# EAGLE design diode_test (EAGLE 6.6.0)
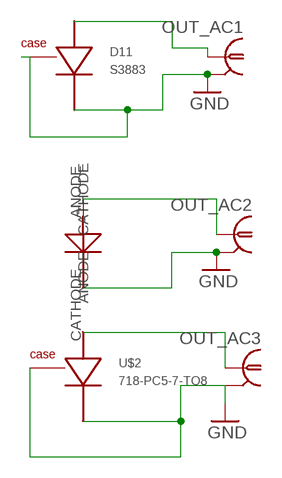
[diagram p0: schematic, sheet 1]

## Parts
D11  S3883  [S3883-CASE]
OUT_AC1  BNC-H  [BNC90]
OUT_AC2  BNC-H  [BNC90]
OUT_AC3  BNC-H  [BNC90]
U$1  718-PC5-7-TO5  [718-PC5-7-TO5]
U$2  718-PC5-7-TO8  [718-PC5-7-TO8]

## Nets
GND: D11.CASE D11.CATHODE OUT_AC1.2 OUT_AC2.2 OUT_AC3.2 U$1.CATHODE U$2.CASE U$2.CATHODE
N$2: D11.ANODE OUT_AC1.1
N$4: OUT_AC2.1 U$1.ANODE
N$6: OUT_AC3.1 U$2.ANODE

## Library data of the parts
D11 = brian_lbr:S3883: Hamamatsu S3883 photodiode
OUT_AC1-OUT_AC3 = connector-jqi:BNC: BNC Connector.; DIGIKEY: A32260-ND
U$1 = brian_lbr:718-PC5-7-TO5
U$2 = brian_lbr:718-PC5-7-TO8

## Board
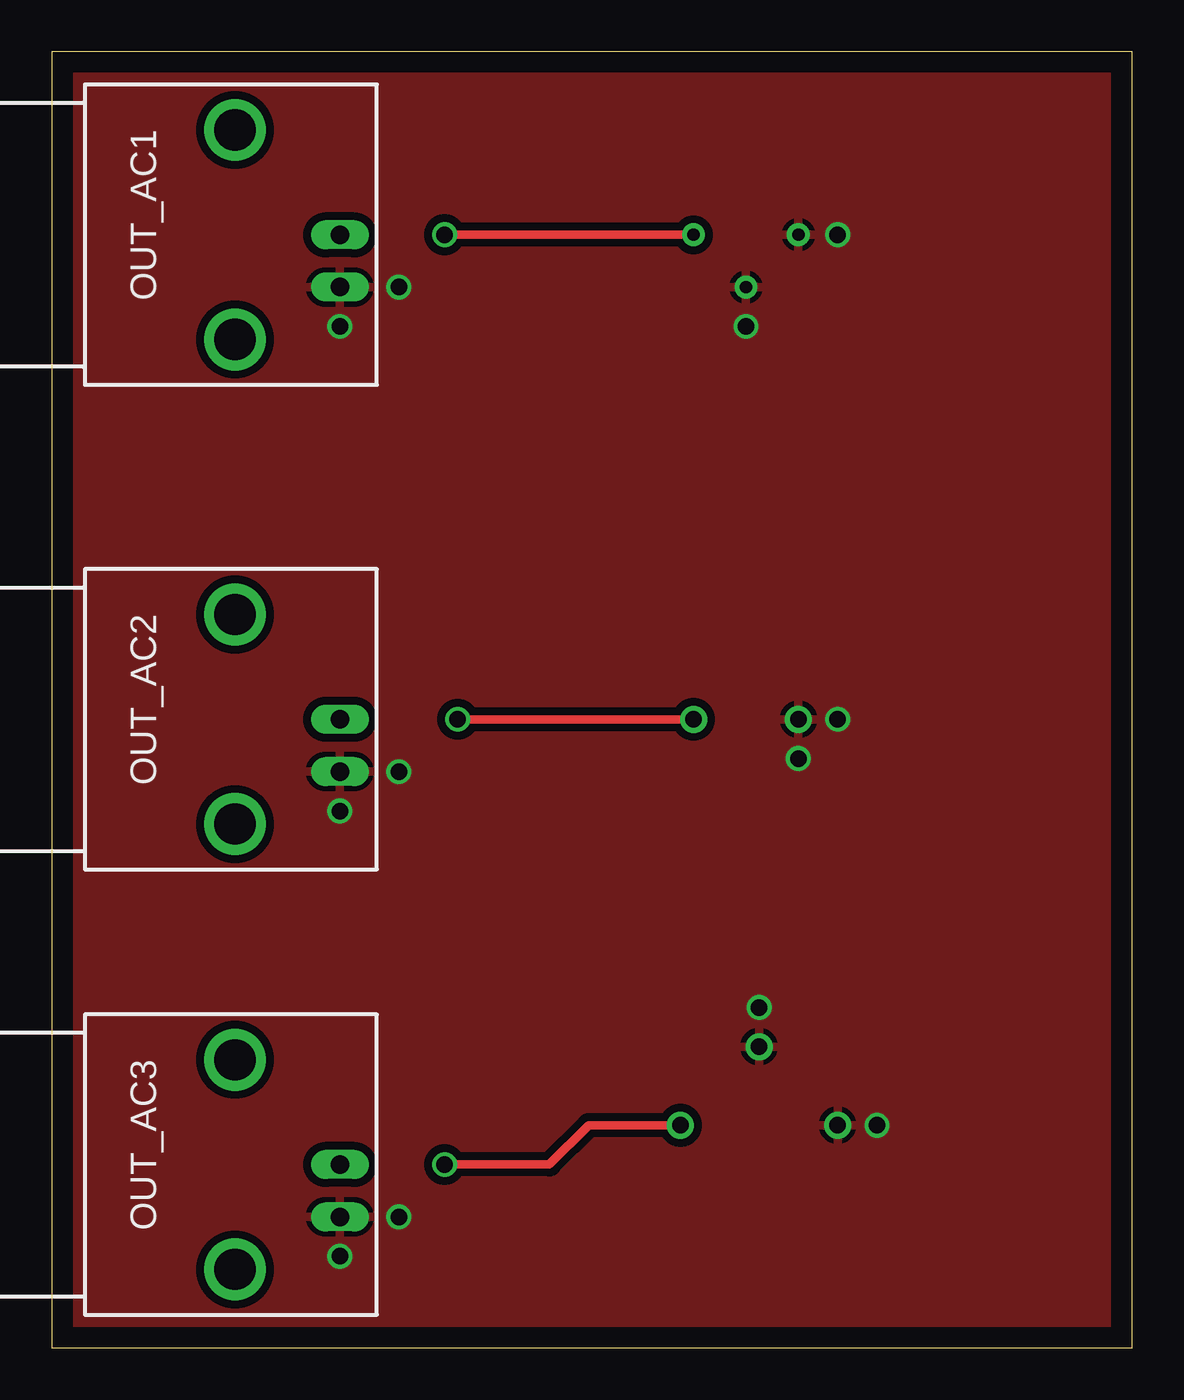
[diagram p1: board, top side]
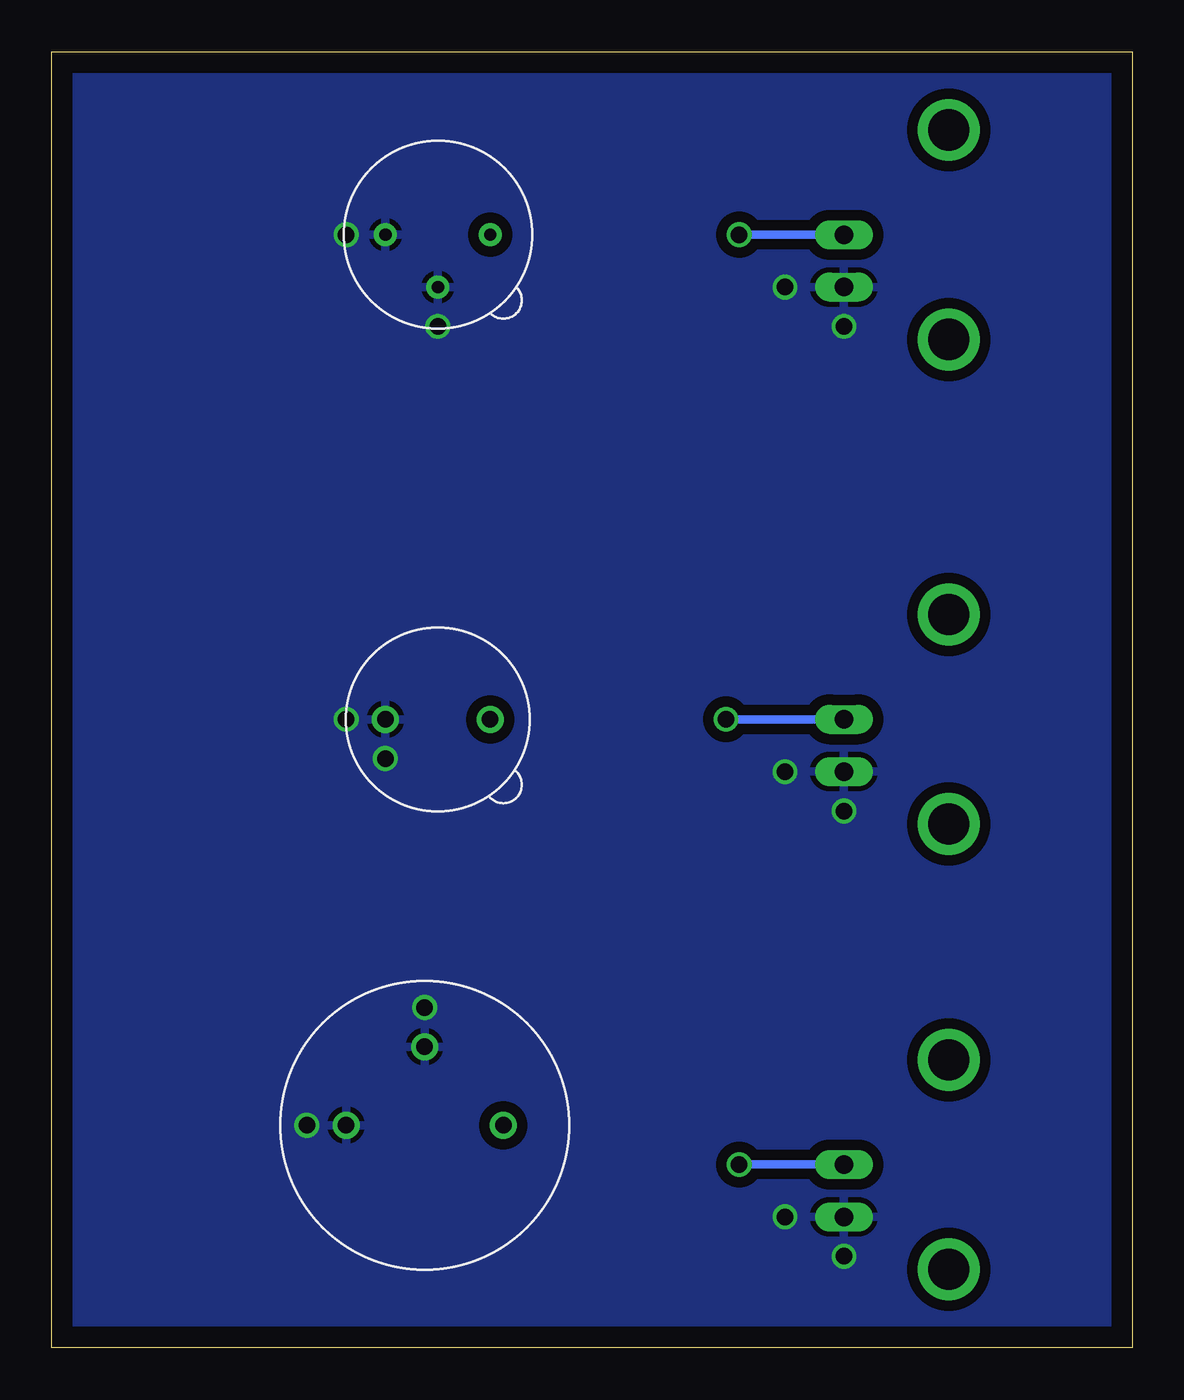
[diagram p2: board, bottom side, seen from below]

Size 52.38 x 62.85 mm. Coordinates in mm from the lower left corner, seen from the top.
Outline: 0,0 52.38,0 52.38,62.85 0,62.85 0,0
Copper layers (1*16): Top 0.035mm / dielectric 1.5mm / Bottom 0.035mm
Design rules "default": minimum track width 10mil, minimum drill 24mil, track to track 8mil, track to pad 8mil, pad to pad 8mil, via to via 8mil, smd to smd 8mil, copper to edge 40mil, drill to drill 8mil, minimum pad ring 10mil, minimum via ring 8mil, stop-mask expansion 4mil, vias tented up to drill 0mil, thermal gap 10mil

### Footprints (pad centres in the part's own frame; a part is rotated, then mirrored left to right if it is on the bottom)
S3883-CASE = drill 0.6: ANODE -2.54,0; CASE 0,2.54; CATHODE 2.54,0
BNC90 = drill 0.9 pad 1.27 long: 1 0,-5.08; 2 -2.54,-5.08 | drill 2 pad 2.032: ANCHOR1 -5.08,0; ANCHOR2 5.08,0
718-PC5-7-TO5 = drill 0.8: ANODE -2.54,0; CATHODE 2.54,0
718-PC5-7-TO8 = drill 0.8: ANODE 3.81,0; CASE 0,3.81; CATHODE -3.81,0

### Placement (x,y rotation side)
D11  33.66,53.98 180 bottom
OUT_AC1  8.89,53.98 90 top
OUT_AC2  8.89,30.48 90 top
OUT_AC3  8.89,8.89 90 top
U$1  33.66,30.48 180 bottom
U$2  34.29,10.79 0 bottom

### Tracks (layer width: path | path; a pad name or v marks a point on that pad's centre or on a via)
GND  (via drill 0.8)
  other vias: 38.1,53.98 33.66,49.53 16.83,51.44 13.97,49.53 38.1,30.48 36.2,28.57 16.83,27.94 13.97,26.04 34.29,16.51 40.01,10.79 13.97,4.45 16.83,6.35
  pour Bottom (isolate 0.508): -0.64,63.5 -1.27,-1.27 53.34,-1.27 53.34,63.5
  pour Top (isolate 0.381): -0.64,63.5 -1.27,-1.27 53.34,-1.27 53.34,63.5
N$2  (via drill 0.8)
  Top 0.406: D11.ANODE v19.05,53.98
  Bottom 0.406: v19.05,53.98 OUT_AC1.1
N$4  (via drill 0.8)
  Top 0.406: U$1.ANODE v19.68,30.48
  Bottom 0.406: v19.68,30.48 OUT_AC2.1
N$6  (via drill 0.8)
  Top 0.406: U$2.ANODE 26.04,10.79 24.13,8.89 v19.05,8.89
  Bottom 0.406: v19.05,8.89 OUT_AC3.1